# EAGLE schematic ProjectUTS (EAGLE 9.3.2)
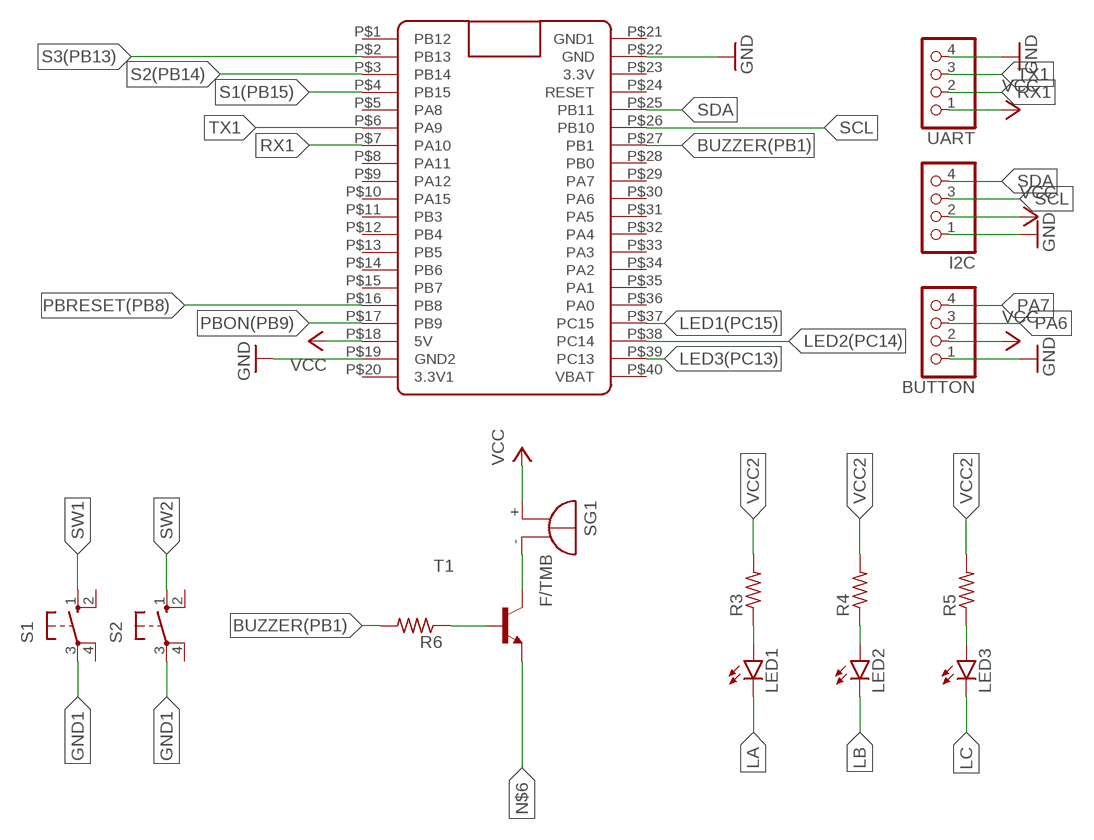
[diagram p0: schematic, sheet 1]

## Parts
BUTTON  PINHD-1X4  [1X04]
I2C  PINHD-1X4  [1X04]
LED1  LED10MM  [LED10MM]
LED2  LED10MM  [LED10MM]
LED3  LED10MM  [LED10MM]
R3  R-US_0207/10  [0207/10]
R4  R-US_0207/10  [0207/10]
R5  R-US_0207/10  [0207/10]
R6  R-US_0207/10  [0207/10]
S1  40-XX  [B3F-40XX]
S2  40-XX  [B3F-40XX]
SG1  F/TMB  [F/TMB]
T1  -NPN-TO92-BCE  [TO92-BCE]
U$1  BLUE_PILL  [BLUE_PILL]
UART  PINHD-1X4  [1X04]

## Nets
BUZZER(PB1): R6.2 U$1.P$27(PB1)
GND1: S1.3(P) S2.3(P)
LA: LED1.K(C)
LB: LED2.K(C)
LC: LED3.K(C)
LED1(PC15): U$1.P$37(PC15)
LED2(PC14): U$1.P$38(PC14)
LED3(PC13): U$1.P$39(PC13)
N$1: LED1.A R3.1
N$2: LED2.A R4.1
N$5: LED3.A R5.1
N$6: BUTTON.1 I2C.1 T1.E U$1.P$19(GND2) U$1.P$22(GND) UART.4 ; supply symbol labelled GND
N$7: R6.1 T1.B
N$8: SG1.- T1.C
N$9: BUTTON.2 I2C.2 SG1.+ U$1.P$18(5V) UART.1 ; supply symbol labelled VCC
PA6: BUTTON.3
PA7: BUTTON.4
PBON(PB9): U$1.P$17(PB9)
PBRESET(PB8): U$1.P$16(PB8)
RX1: U$1.P$7(PA10) UART.2
S1(PB15): U$1.P$4(PB15)
S2(PB14): U$1.P$3(PB14)
S3(PB13): U$1.P$2(PB13)
SCL: I2C.3 U$1.P$26(PB10)
SDA: I2C.4 U$1.P$25(PB11)
SW1: S1.1(S)
SW2: S2.1(S)
TX1: U$1.P$6(PA9) UART.3
VCC2: R3.2 R4.2 R5.2
Unconnected: S1.2(S1) S1.4(P1) S2.2(S1) S2.4(P1) U$1.P$1(PB12) U$1.P$5(PA8) U$1.P$8(PA11) U$1.P$9(PA12) U$1.P$10(PA15) U$1.P$11(PB3) U$1.P$12(PB4) U$1.P$13(PB5) U$1.P$14(PB6) U$1.P$15(PB7) U$1.P$20(3.3V1) U$1.P$23(3.3V) U$1.P$24(RESET) U$1.P$28(PB0) U$1.P$29(PA7) U$1.P$30(PA6) U$1.P$31(PA5) U$1.P$32(PA4) U$1.P$33(PA3) U$1.P$34(PA2) U$1.P$35(PA1) U$1.P$36(PA0) U$1.P$40(VBAT)

## Power pins joined to a net without a drawn wire
GND1: U$1.P$21(GND1)

## Library data of the parts
BUTTON I2C UART = pinhead:PINHD-1X4: PIN HEADER
LED1-LED3 = led:LED: LED OSRAM: - CHIPLED LG R971, LG N971, LY N971, LG Q971, LY Q971, LO R971, LY R971 LH N974, LH R974 LS Q976, LO Q976, LY Q976 LO Q996 - Hyper CHIPLED LW Q18S LB Q993, LB Q99A, LB R99A - SideLED LS A670, LO A670, LY A670, LG A670, LP A670 LB A673, LV A673, LT A673, LW A673 LH A674 LY A675 LS A676, LA A676, LO A676, LY A676, LW A676 LS A679, LY A679, LG A679 - Hyper Micro SIDELED® LS Y876, LA Y876, LO Y876, LY Y876 LT Y87S - SmartLED LW L88C, LW L88S LB L89C, LB L89S, LG L890 LS L89K, LO L89K, LY L89K LS L896, LA L896, LO L896, LY L896 - TOPLED LS T670, LO T670, LY T670, LG T670, LP T670 LSG T670, LSP T670, LSY T670, LOP T670, LYG T670 LG T671, LOG T671, LSG T671 LB T673, LV T673, LT T673, LW T673 LH T674 LS T676, LA T676, LO T676, LY T676, LB T676, LH T676, LSB T676, LW T676 LB T67C, LV T67C, LT T67C, LS T67K, LO T67K, LY T67K, LW E67C LS E67B, LA E67B, LO E67B, LY E67B, LB E67C, LV E67C, LT E67C LW T67C LS T679, LY T679, LG T679 LS T770, LO T770, LY T770, LG T770, LP T770 LB T773, LV T773, LT T773, LW T773 LH T774 LS E675, LA E675, LY E675, LS T675 LS T776, LA T776, LO T776, LY T776, LB T776 LHGB T686 LT T68C, LB T68C - Hyper Mini TOPLED® LB M676 - Mini TOPLED Santana® LG M470 LS M47K, LO M47K, LY M47K Source: http://www.osram.convergy.de LUXEON: - LUMILED® LXK2-PW12-R00, LXK2-PW12-S00, LXK2-PW14-U00, LXK2-PW14-V00 LXK2-PM12-R00, LXK2-PM12-S00, LXK2-PM14-U00 LXK2-PE12-Q00, LXK2-PE12-R00, LXK2-PE12-S00, LXK2-PE14-T00, LXK2-PE14-U00 LXK2-PB12-K00, LXK2-PB12-L00, LXK2-PB12-M00, LXK2-PB14-N00, LXK2-PB14-P00, LXK2-PB14-Q00 LXK2-PR12-L00, LXK2-PR12-M00, LXK2-PR14-Q00, LXK2-PR14-R00 LXK2-PD12-Q00, LXK2-PD12-R00, LXK2-PD12-S00 LXK2-PH12-R00, LXK2-PH12-S00 LXK2-PL12-P00, LXK2-PL12-Q00, LXK2-PL12-R00 Source: www.luxeon.com KINGBRIGHT: KA-3528ASYC Source: www.kingbright.com
R3-R6 = rcl:R-US_: RESISTOR, American symbol; SPICEPREFIX: R
S1 S2 = switch-omron:40-XX: OMRON SWITCH; MF: OMRON COMPONENTS USA; MPN: B3F-4000; OC_FARNELL: 176434; OC_NEWARK: 36K3105
SG1 = buzzer:F/TMB: BUZZER Source: Buerklin; OC_FARNELL: unknown; OC_NEWARK: unknown
T1 = transistor-neu-to92:*-NPN-: NPN Transistror
U$1 = BluePill:BLUE_PILL